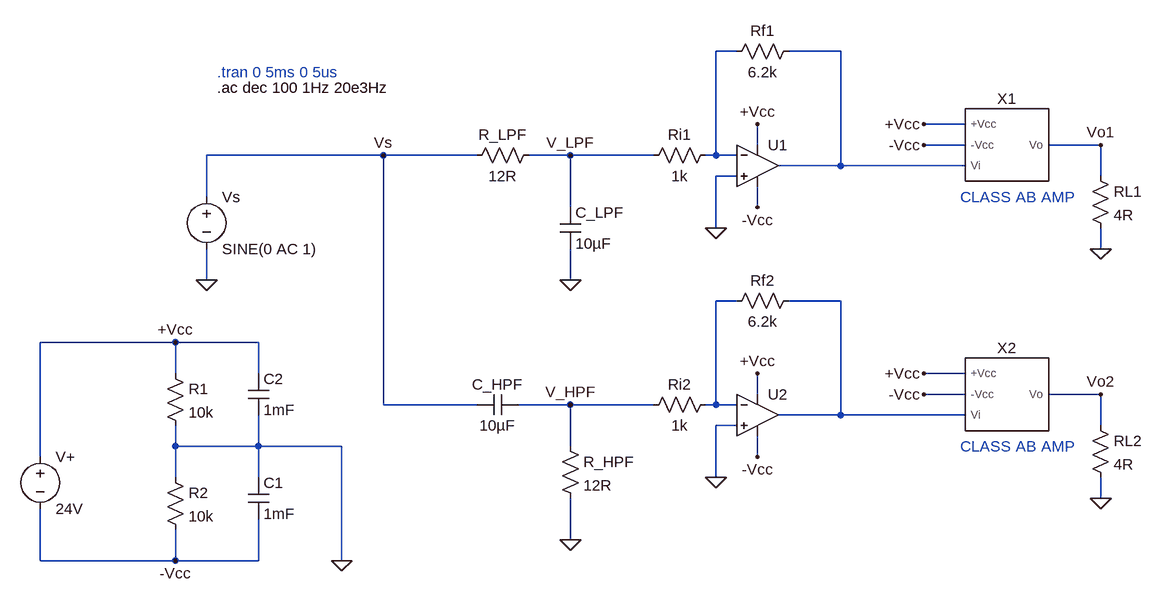
[diagram p0: schematic main.asc]
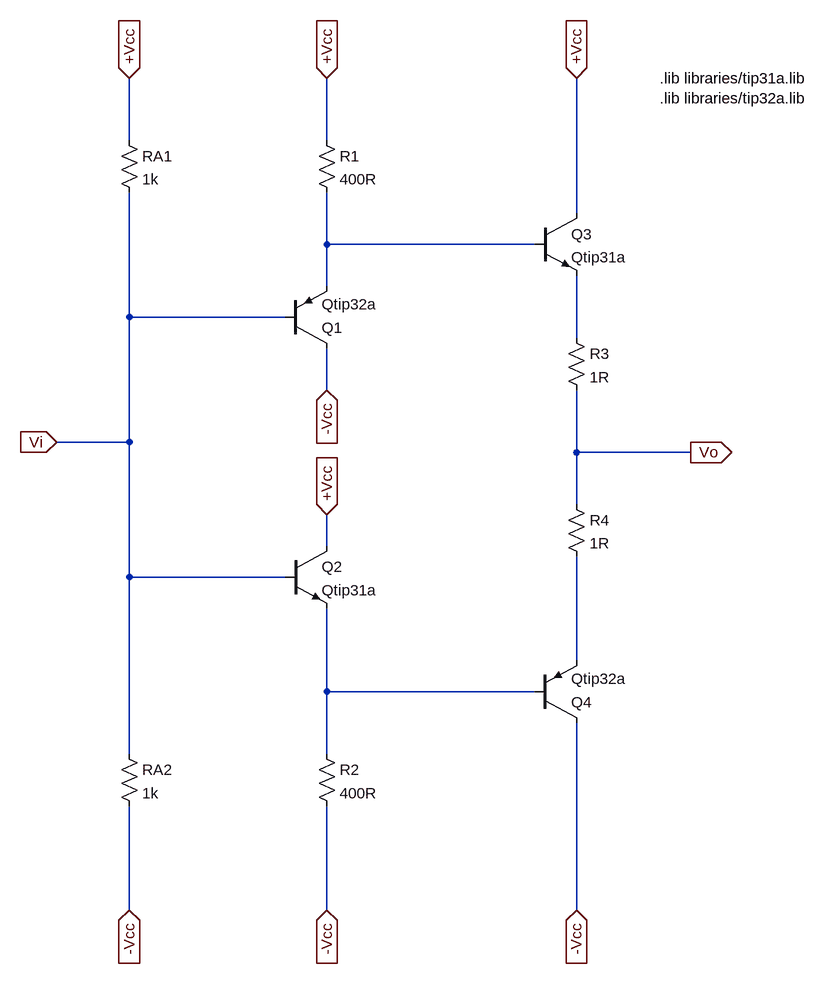
[diagram p1: sub-circuit ab-power-amp.asc]
main.asc, the LTspice schematic file:
Version 4
SHEET 1 1240 1468
WIRE 304 160 272 160
WIRE 464 160 384 160
WIRE 656 272 592 272
WIRE 336 304 336 272
WIRE 656 304 592 304
WIRE 864 304 784 304
WIRE -240 320 -512 320
WIRE -96 320 -240 320
WIRE 48 320 -16 320
WIRE 176 320 48 320
WIRE 272 320 272 160
WIRE 272 320 256 320
WIRE 304 320 272 320
WIRE 464 336 464 160
WIRE 464 336 368 336
WIRE 656 336 464 336
WIRE 304 352 272 352
WIRE 864 352 864 304
WIRE -512 384 -512 320
WIRE 48 400 48 320
WIRE 336 400 336 368
WIRE 272 432 272 352
WIRE 864 464 864 432
WIRE -512 512 -512 464
WIRE 48 512 48 464
WIRE 304 544 272 544
WIRE 464 544 384 544
WIRE -560 608 -768 608
WIRE -432 608 -560 608
WIRE -560 656 -560 608
WIRE -432 656 -432 608
WIRE 656 656 592 656
WIRE 336 688 336 656
WIRE 656 688 592 688
WIRE 864 688 784 688
WIRE -240 704 -240 320
WIRE -96 704 -240 704
WIRE 48 704 -32 704
WIRE 176 704 48 704
WIRE 272 704 272 544
WIRE 272 704 256 704
WIRE 304 704 272 704
WIRE 464 720 464 544
WIRE 464 720 368 720
WIRE 656 720 464 720
WIRE 304 736 272 736
WIRE 864 736 864 688
WIRE -560 768 -560 736
WIRE -432 768 -432 720
WIRE -432 768 -560 768
WIRE -304 768 -432 768
WIRE 48 768 48 704
WIRE -768 784 -768 608
WIRE 336 784 336 752
WIRE -560 816 -560 768
WIRE -432 816 -432 768
WIRE 272 816 272 736
WIRE 864 848 864 816
WIRE 48 912 48 848
WIRE -768 944 -768 864
WIRE -560 944 -560 896
WIRE -560 944 -768 944
WIRE -432 944 -432 880
WIRE -432 944 -560 944
WIRE -304 944 -304 768
FLAG -560 608 +Vcc
FLAG -304 944 0
FLAG -560 944 -Vcc
FLAG -512 512 0
FLAG 48 512 0
FLAG 48 912 0
FLAG -240 320 Vs
FLAG 48 320 V_LPF
FLAG 48 704 V_HPF
FLAG 336 272 +Vcc
FLAG 336 656 +Vcc
FLAG 336 400 -Vcc
FLAG 336 784 -Vcc
FLAG 272 432 0
FLAG 272 816 0
FLAG 592 272 +Vcc
FLAG 592 656 +Vcc
FLAG 592 304 -Vcc
FLAG 592 688 -Vcc
FLAG 864 464 0
FLAG 864 848 0
FLAG 864 304 Vo1
FLAG 864 688 Vo2
SYMBOL voltage -768 768 R0
SYMATTR InstName V+
SYMATTR Value 24V
SYMBOL voltage -512 368 R0
WINDOW 123 0 0 Left 0
WINDOW 39 0 0 Left 0
SYMATTR InstName Vs
SYMATTR Value SINE(0 AC 1)
SYMBOL res 0 304 R90
WINDOW 0 0 56 VBottom 2
WINDOW 3 32 56 VTop 2
SYMATTR InstName R_LPF
SYMATTR Value 12R
SYMBOL cap 32 400 R0
SYMATTR InstName C_LPF
SYMATTR Value 10µF
SYMBOL cap -32 688 R90
WINDOW 0 0 32 VBottom 2
WINDOW 3 32 32 VTop 2
SYMATTR InstName C_HPF
SYMATTR Value 10µF
SYMBOL res 32 752 R0
SYMATTR InstName R_HPF
SYMATTR Value 12R
SYMBOL res 272 304 R90
WINDOW 0 0 56 VBottom 2
WINDOW 3 32 56 VTop 2
SYMATTR InstName Ri1
SYMATTR Value 1k
SYMBOL res 400 144 R90
WINDOW 0 0 56 VBottom 2
WINDOW 3 32 56 VTop 2
SYMATTR InstName Rf1
SYMATTR Value 6.2k
SYMBOL res 400 528 R90
WINDOW 0 0 56 VBottom 2
WINDOW 3 32 56 VTop 2
SYMATTR InstName Rf2
SYMATTR Value 6.2k
SYMBOL res 272 688 R90
WINDOW 0 0 56 VBottom 2
WINDOW 3 32 56 VTop 2
SYMATTR InstName Ri2
SYMATTR Value 1k
SYMBOL OpAmps\\UniversalOpAmp 336 336 R0
SYMATTR InstName U1
SYMBOL OpAmps\\UniversalOpAmp 336 720 R0
SYMATTR InstName U2
SYMBOL res 848 336 R0
SYMATTR InstName RL1
SYMATTR Value 4R
SYMBOL res 848 720 R0
SYMATTR InstName RL2
SYMATTR Value 4R
SYMBOL ab-power-amp 720 304 R0
SYMATTR InstName X1
SYMBOL ab-power-amp 720 688 R0
SYMATTR InstName X2
SYMBOL res -576 640 R0
SYMATTR InstName R1
SYMATTR Value 10k
SYMBOL res -576 800 R0
SYMATTR InstName R2
SYMATTR Value 10k
SYMBOL cap -448 816 R0
SYMATTR InstName C1
SYMATTR Value 1mF
SYMBOL cap -448 656 R0
SYMATTR InstName C2
SYMATTR Value 1mF
TEXT -496 216 Left 2 !.ac dec 100 1Hz 20e3Hz
TEXT 648 384 Left 2 ;CLASS AB AMP
TEXT 648 768 Left 2 ;CLASS AB AMP
TEXT -496 192 Left 2 ;.tran 0 5ms 0 5us

ab-power-amp.asc, the sub-circuit schematic file:
Version 4
SHEET 1 880 680
WIRE -560 -1936 -560 -2032
WIRE -256 -1936 -256 -2032
WIRE 128 -1824 128 -2032
WIRE -256 -1776 -256 -1856
WIRE 64 -1776 -256 -1776
WIRE -256 -1712 -256 -1776
WIRE -560 -1664 -560 -1856
WIRE -320 -1664 -560 -1664
WIRE 128 -1632 128 -1728
WIRE -256 -1552 -256 -1616
WIRE -560 -1472 -560 -1664
WIRE -560 -1472 -672 -1472
WIRE 128 -1456 128 -1552
WIRE 304 -1456 128 -1456
WIRE 128 -1376 128 -1456
WIRE -256 -1312 -256 -1360
WIRE -560 -1264 -560 -1472
WIRE -320 -1264 -560 -1264
WIRE 128 -1136 128 -1296
WIRE -256 -1088 -256 -1216
WIRE 64 -1088 -256 -1088
WIRE -560 -992 -560 -1264
WIRE -256 -992 -256 -1088
WIRE -560 -752 -560 -912
WIRE -256 -752 -256 -912
WIRE 128 -752 128 -1040
FLAG -560 -2032 +Vcc
IOPIN -560 -2032 In
FLAG -560 -752 -Vcc
IOPIN -560 -752 In
FLAG 304 -1456 Vo
IOPIN 304 -1456 Out
FLAG -256 -2032 +Vcc
IOPIN -256 -2032 In
FLAG 128 -2032 +Vcc
IOPIN 128 -2032 In
FLAG -256 -1360 +Vcc
IOPIN -256 -1360 In
FLAG -256 -752 -Vcc
IOPIN -256 -752 In
FLAG 128 -752 -Vcc
IOPIN 128 -752 In
FLAG -256 -1552 -Vcc
IOPIN -256 -1552 In
FLAG -672 -1472 Vi
IOPIN -672 -1472 In
SYMBOL npn -320 -1312 R0
SYMATTR InstName Q2
SYMATTR Value Qtip31a
SYMBOL pnp 64 -1040 M180
SYMATTR InstName Q4
SYMATTR Value Qtip32a
SYMBOL npn 64 -1824 R0
SYMATTR InstName Q3
SYMATTR Value Qtip31a
SYMBOL pnp -320 -1616 M180
SYMATTR InstName Q1
SYMATTR Value Qtip32a
SYMBOL res -576 -1952 R0
SYMATTR InstName RA1
SYMATTR Value 1k
SYMBOL res -576 -1008 R0
SYMATTR InstName RA2
SYMATTR Value 1k
SYMBOL res -272 -1952 R0
SYMATTR InstName R1
SYMATTR Value 400R
SYMBOL res -272 -1008 R0
SYMATTR InstName R2
SYMATTR Value 400R
SYMBOL res 112 -1648 R0
SYMATTR InstName R3
SYMATTR Value 1R
SYMBOL res 112 -1392 R0
SYMATTR InstName R4
SYMATTR Value 1R
TEXT 256 -2032 Left 2 !.lib libraries/tip31a.lib\n.lib libraries/tip32a.lib

The netlist it stands for:
* main.asc
V+ +Vcc -Vcc 24V
Vs Vs 0 SINE(0 AC 1)
R_LPF V_LPF Vs 12R
C_LPF V_LPF 0 10µF
C_HPF V_HPF Vs 10µF
R_HPF V_HPF 0 12R
Ri1 N001 V_LPF 1k
Rf1 N002 N001 6.2k
Rf2 N004 N003 6.2k
Ri2 N003 V_HPF 1k
XU1 0 N001 +Vcc -Vcc N002 level1 Avol=1Meg GBW=10Meg Vos=0 En=0 Enk=0 In=0 Ink=0 Rin=500Meg  ; pins In+ In- V+ V- OUT
XU2 0 N003 +Vcc -Vcc N004 level1 Avol=1Meg GBW=10Meg Vos=0 En=0 Enk=0 In=0 Ink=0 Rin=500Meg  ; pins In+ In- V+ V- OUT
RL1 Vo1 0 4R
RL2 Vo2 0 4R
XX1 +Vcc -Vcc N002 Vo1 ab-power-amp
XX2 +Vcc -Vcc N004 Vo2 ab-power-amp
R1 +Vcc 0 10k
R2 0 -Vcc 10k
C1 0 -Vcc 1mF
C2 +Vcc 0 1mF

* block symbol definitions
.subckt ab-power-amp +Vcc -Vcc Vi Vo
Q2 +Vcc Vi N004 0 Qtip31a
Q4 -Vcc N004 N003 0 Qtip32a
Q3 +Vcc N001 N002 0 Qtip31a
Q1 -Vcc Vi N001 0 Qtip32a
RA1 +Vcc Vi 1k
RA2 Vi -Vcc 1k
R1 +Vcc N001 400R
R2 N004 -Vcc 400R
R3 N002 Vo 1R
R4 Vo N003 1R
.lib libraries/tip31a.lib
.lib libraries/tip32a.lib
.ends ab-power-amp

.model NPN NPN
.model PNP PNP
.lib standard.bjt
.ac dec 100 1Hz 20e3Hz
* CLASS AB AMP
* CLASS AB AMP
* .tran 0 5ms 0 5us
.lib UniversalOpAmp1.lib
.backanno
.end